# Altium schematic sheet Sheet_1_2020-11-09_21-14-08.schdoc
size 307 x 219 mm
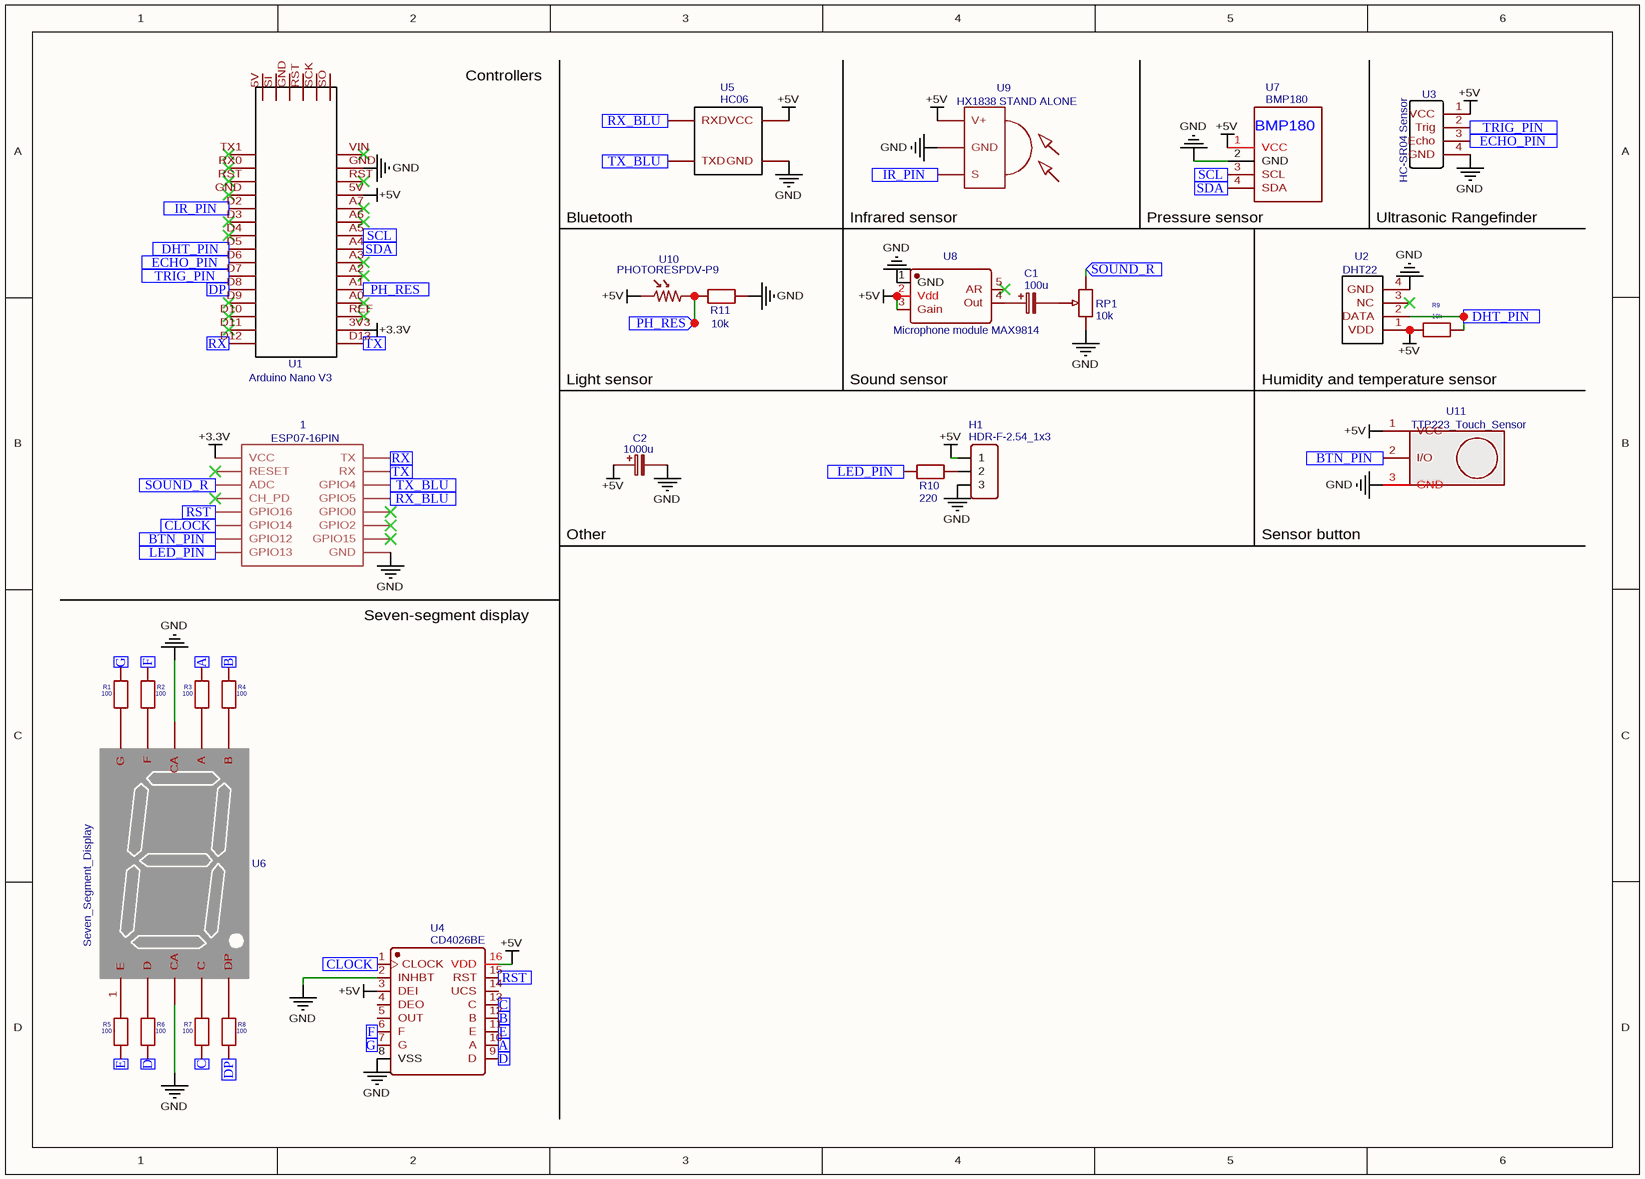
[diagram p0: Sheet_1_2020-11-09_21-14-08.schdoc]

## Parts
1  ESP07-16PIN  [ESP07]
C1  100u  [CASE-A_3216]
C2  1000u  [CASE-A_3216]
H1  HDR-F-2.54_1x3  [HDR-F-2.54_1X3]
R1  100  [R0603]
R2  100  [R0603]
R3  100  [R0603]
R4  100  [R0603]
R5  100  [R0603]
R6  100  [R0603]
R7  100  [R0603]
R8  100  [R0603]
R9  10k  [R0603]
R10  220  [R0603]
R11  10k  [R0603]
RP1  10k  [RES-ADJ-TH_3386P]
U1  Arduino Nano V3  [ARDUINO NANO V3]
U2  DHT22  [DHT22_AM2303_VERT]
U3  HC-SR04 Sensor  [MY HC-SR04]
U4  CD4026BE  [DIP-16]
U5  HC06  [BLUETOOTH_HC-06]
U6  Seven_Segment_Display
U7  BMP180  [BMP180_NICKS]
U8  Microphone module MAX9814  [MICROPHONE MODULE MAX9814]
U9  HX1838 STAND ALONE  [HX1838 STAND ALONE]
U10  PHOTORESPDV-P9  [PDV-P9XXX]
U11  TTP223_Touch_Sensor  [TTP223_TOUCH_MODULE_DOC]

## Ports
A (in), B (in), BTN_PIN (in), C (in), CLOCK (in), D (in), DHT_PIN (in), DP (in), E (in), ECHO_PIN (in), F (in), G (in), IR_PIN (in), LED_PIN (in), PH_RES (in), RST (in), RX (in), RX_BLU (in), SCL (in), SDA (in), SOUND_R (in), TRIG_PIN (in), TX (in), TX_BLU (in)

## Nets
+3.3V: 1.VCC U1.3V3
+5V: C2.1 H1.1 R9.1 U1.5V U2.1(VDD) U3.1(VCC) U4.3(DEI) U4.16(VDD) U5.1(VCC) U7.1(VCC) U8.2(Vdd) U8.3(Gain) U9.VCC(V+) U10.1 U11.1(VCC)
GND: 1.GND C2.2 H1.3 R11.2 RP1.1 U1.GND U2.4(GND) U3.4(GND) U4.2(INHBT) U4.8(VSS) U5.2(GND) U6.3(CA) U6.8(CA) U7.2(GND) U8.1(GND) U9.GND U11.3(GND)
A: R3.1 U4.10(A) ; port A
B: R4.1 U4.12(B) ; port B
BTN_PIN: 1.GPIO12 U11.2(I/O) ; port BTN_PIN
C: R7.2 U4.13(C) ; port C
CLOCK: 1.GPIO14 U4.1(CLOCK) ; port CLOCK
D: R6.2 U4.9(D) ; port D
DHT_PIN: R9.2 U1.D5 U2.2(DATA) ; port DHT_PIN
DP: R8.2 U1.D8 ; port DP
E: R5.2 U4.11(E) ; port E
ECHO_PIN: U1.D6 U3.3(Echo) ; port ECHO_PIN
F: R2.1 U4.6(F) ; port F
G: R1.1 U4.7(G) ; port G
IR_PIN: U1.D2 U9.S ; port IR_PIN
LED_PIN: 1.GPIO13 R10.1 ; port LED_PIN
PH_RES: R11.1 U1.A1 U10.2 ; port PH_RES
RST: 1.GPIO16 U4.15(RST) ; port RST
RX: 1.TX U1.D12 ; port RX
RX_BLU: 1.GPIO5 U5.4(RXD) ; port RX_BLU
SCL: U1.A5 U7.3(SCL) ; port SCL
SDA: U1.A4 U7.4(SDA) ; port SDA
SOUND_R: 1.ADC RP1.3 ; port SOUND_R
TRIG_PIN: U1.D7 U3.2(Trig) ; port TRIG_PIN
TX: 1.RX U1.D13 ; port TX
TX_BLU: 1.GPIO4 U5.3(TXD) ; port TX_BLU
NetC1_1: C1.1 U8.4(Out)
NetC1_2: C1.2 RP1.2
NetH1_2: H1.2 R10.2
NetR1_2: R1.2 U6.10(G)
NetR2_2: R2.2 U6.9(F)
NetR3_2: R3.2 U6.7(A)
NetR4_2: R4.2 U6.6(B)
NetR5_1: R5.1 U6.1(E)
NetR6_1: R6.1 U6.2(D)
NetR7_1: R7.1 U6.4(C)
NetR8_1: R8.1 U6.5(DP)

Not connected (* = marked no-connect by the designer): 1 CH_PD* GPIO0* GPIO2* GPIO15* REST(RESET)*; U1 A0(19)* A2(21)* A3(22)* A6(25)* A7(26)* D3(6)* D4(7)* D9(12)* D10(13)* D11(14)* REF(18)* RST(3)* RX0(2)* SCK(32) SI(35) SO(31) TX1(1)* VIN(30)*; U2 3(NC)*; U4 4(DEO) 5(OUT) 14(UCS); U8 5(AR)*

## Notes on the sheet
- Controllers
- Bluetooth
- Infrared sensor
- (near U7) Pressure sensor
- Ultrasonic Rangefinder
- Light sensor
- Sound sensor
- Humidity and temperature sensor
- Other
- Sensor button
- Seven-segment display

## Library data of the parts
1 = ESP07-16PIN: Contributor: moudjibou; spicePre: ?; spiceSymbolName: ESP07-16PIN
C1 = 100u: nameAlias: Value(F); Contributor: LCEDA_Lib; spicePre: C; spiceSymbolName: C_Tan_SMD_A_EU
C2 = 1000u: nameAlias: Value(F); Contributor: LCEDA_Lib; spicePre: C; spiceSymbolName: C_Tan_SMD_A_EU
H1 = HDR-F-2.54_1x3: Contributor: LCEDA_Lib; BOM_Supplier Part: C146690; BOM_Supplier: LCSC; spicePre: H; spiceSymbolName: HDR-F-2.54_1x3
R1-R8 = 100: nameAlias: Value(Ω); Contributor: LCEDA_Lib; spicePre: R; spiceSymbolName: R_0603_EU
R9 R11 = 10k: nameAlias: Value(Ω); Contributor: LCEDA_Lib; spicePre: R; spiceSymbolName: R_0603_EU
R10 = 220: nameAlias: Value(Ω); Contributor: LCEDA_Lib; spicePre: R; spiceSymbolName: R_0603_EU
RP1 = 10k: nameAlias: Resistance (Ohms); Contributor: LCEDA_Lib; BOM_Supplier: LCSC; Value(Ω): 10K; spicePre: R; spiceSymbolName: R_3386P_EU
U1 = Arduino Nano V3: Contributor: rampage-128; BOM_Manufacturer Part: Arduino Nano V3; spicePre: U; spiceSymbolName: Arduino Nano V3
U3 = HC-SR04 Sensor: BOM_Manufacturer Part: Pin_Header_4P; Contributor: Mohammed Al-shatti; spicePre: U; spiceSymbolName: My HC-SR04 Sensor
U4 = CD4026BE: BOM_Manufacturer: TI; Contributor: vkomendyak; BOM_Supplier: LCSC; BOM_Manufacturer Part: CD4026BE; BOM_Supplier Part: C89909; spicePre: U; spiceSymbolName: CD4026BE
U5 = HC06: Contributor: h6000p; BOM_Manufacturer Part: HC06; spicePre: U; spiceSymbolName: HC06
U6 = Seven_Segment_Display: Contributor: Saroja patil; timeStamp: 1461456025; spicePre: U; spiceSymbolName: Seven_Segment_Display
U7 = BMP180: Contributor: ndamo; BOM_Manufacturer Part: BMP180; spicePre: U; spiceSymbolName: BMP180_NICKS
U8 = Microphone module MAX9814: Contributor: Eleonora; BOM_Manufacturer Part: Microphone module MAX9814; spicePre: U; spiceSymbolName: Microphone module MAX9814
U9 = HX1838 STAND ALONE: Contributor: kleanair; spicePre: U; spiceSymbolName: HX1838 STAND ALONE
U10 = PHOTORESPDV-P9: Contributor: Jose Andres Murillo Duran; spicePre: R; spiceSymbolName: PHOTORESPDV-P9
U11 = TTP223_Touch_Sensor: BOM_Manufacturer Part: TTP223 BREAKOUT; Contributor: Muhammad Younus; spicePre: U; spiceSymbolName: TTP223_Touch_Sensor
U2 = DHT22: BOM_Manufacturer Part: DHT22; spicePre: U; spiceSymbolName: DHT22